# EAGLE design MEAS-ADXL354 (EAGLE 9.6.2)
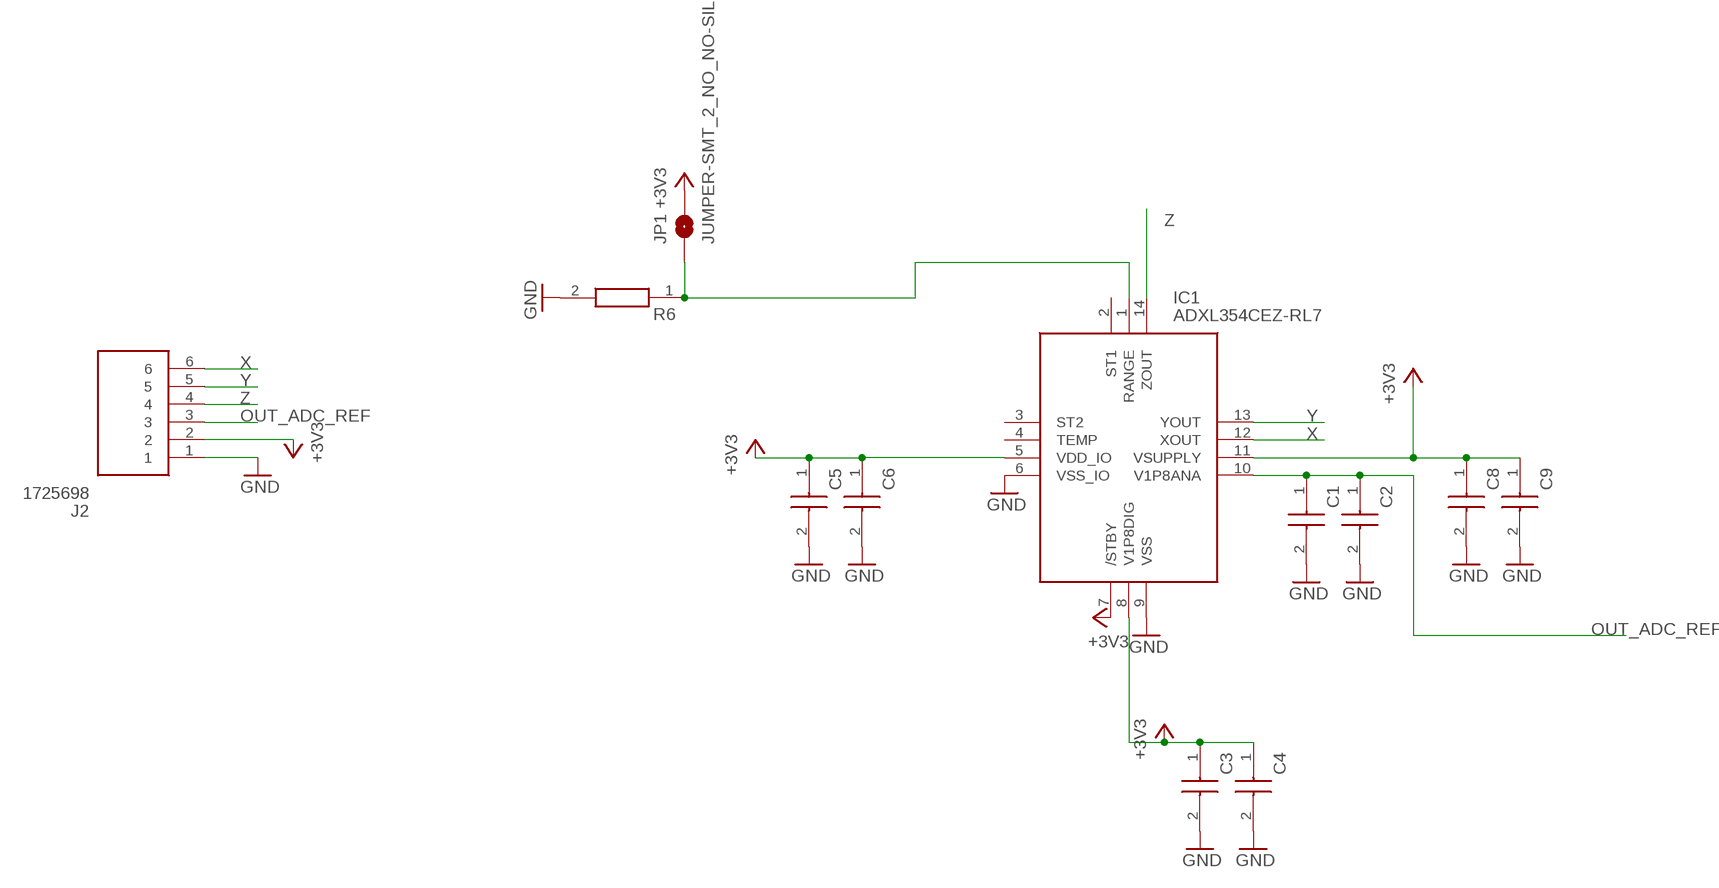
[diagram p0: schematic, sheet 1]

## Parts
C1  1.0uF  LMK105BJ225KV-F  [CAPC1005X55N]
C2  0.1uF  885012105010  [CAPC1005X55N]
C3  1.0uF  LMK105BJ225KV-F  [CAPC1005X55N]
C4  0.1uF  885012105010  [CAPC1005X55N]
C5  1.0uF  LMK105BJ225KV-F  [CAPC1005X55N]
C6  0.1uF  885012105010  [CAPC1005X55N]
C8  1.0uF  LMK105BJ225KV-F  [CAPC1005X55N]
C9  0.1uF  885012105010  [CAPC1005X55N]
IC1  ADXL354CEZ-RL7  [PLCC127P602X560X205-14N]
J2  1725698  [1725698]
JP1  JUMPER-SMT_2_NO_NO-SILK  [SMT-JUMPER_2_NO_NO-SILK]
R6  SFR03EZPF6801  [RESC1608X55N]

## Nets
+3V3: C3.1 C4.1 C5.1 C6.1 C8.1 C9.1 IC1.5(VDD_IO) IC1.7(/STBY) IC1.8(V1P8DIG) IC1.11(VSUPPLY) J2.2 JP1.2
GND: C1.2 C2.2 C3.2 C4.2 C5.2 C6.2 C8.2 C9.2 IC1.6(VSS_IO) IC1.9(VSS) J2.1 R6.2
N$1: IC1.1(RANGE) JP1.1 R6.1
OUT_ADC_REF: C1.1 C2.1 IC1.10(V1P8ANA) J2.3
X: IC1.12(XOUT) J2.6
Y: IC1.13(YOUT) J2.5
Z: IC1.14(ZOUT) J2.4
Unconnected: IC1.2(ST1) IC1.3(ST2) IC1.4(TEMP)

## Library data of the parts
C1 C3 C5 C8 = LMK105BJ225KV-F:LMK105BJ225KV-F: TAIYO YUDEN - LMK105BJ225KV-F - CAP ,MLCC ,0402,10V ,X5R,2.2UF10% ,T&R Source: Datasheet <https://datasheet.lcsc.com/szlcsc/Taiyo-Yuden-LMK105BJ225KV-F_C319191.pdf>; DESCRIPTION: TAIYO YUDEN - LMK105BJ225KV-F - CAP ,MLCC ,0402,10V ,X5R,2.2UF10% ,T&R; HEIGHT: 0.55mm; MANUFACTURER_NAME: TAIYO YUDEN; MANUFACTURER_PART_NUMBER: LMK105BJ225KV-F; MOUSER_PART_NUMBER: 963-LMK105BJ225KV-F; MOUSER_PRICE-STOCK: https://www.mouser.co.uk/ProductDetail/Taiyo-Yuden/LMK105BJ225KV-F?qs=lkMpTOwszhdMcDOeuc5Dig%3D%3D
C2 C4 C6 C9 = 885012105010:885012105010: Multilayer Ceramic Chip Capacitor WCAP-CSGP Series 0402 100000pF X5R0402104M010DFCT10000 Source: Datasheet <https://katalog.we-online.com/pbs/datasheet/885012105010.pdf>; DESCRIPTION: Multilayer Ceramic Chip Capacitor WCAP-CSGP Series 0402 100000pF X5R0402104M010DFCT10000; HEIGHT: 0.55mm; MANUFACTURER_NAME: Wurth Elektronik; MANUFACTURER_PART_NUMBER: 885012105010; MOUSER_PART_NUMBER: 710-885012105010; MOUSER_PRICE-STOCK: https://www.mouser.co.uk/ProductDetail/Wurth-Elektronik/885012105010?qs=0KOYDY2FL298aE%252BL5D%252BNKw%3D%3D
IC1 = ADXL354CEZ-RL7:ADXL354CEZ-RL7: Accelerometer Triple +/-2g/+/-8g 3.3V 368mv/g to 432mv/g/92mv/g to 108mv/g 14-Pin CLLCC T/R Source: Datasheet <https://www.analog.com/media/en/technical-documentation/data-sheets/ADXL354_355.pdf>; DESCRIPTION: Accelerometer Triple +/-2g/+/-8g 3.3V 368mv/g to 432mv/g/92mv/g to 108mv/g 14-Pin CLLCC T/R; HEIGHT: 2.05mm; MANUFACTURER_NAME: Analog Devices; MANUFACTURER_PART_NUMBER: ADXL354CEZ-RL7
J2 = 1725698:1725698: Conn PC Terminal Block 6 POS 2.54mm Solder ST Thru-Hole 6A Source: Datasheet <https://componentsearchengine.com/Datasheets/2/1725698.pdf>; DESCRIPTION: Conn PC Terminal Block 6 POS 2.54mm Solder ST Thru-Hole 6A; HEIGHT: 8.65mm; MANUFACTURER_NAME: Phoenix Contact; MANUFACTURER_PART_NUMBER: 1725698; MOUSER_PART_NUMBER: 651-1725698; MOUSER_PRICE-STOCK: https://www.mouser.co.uk/ProductDetail/Phoenix-Contact/1725698?qs=Ul7CXFMnlWUIR3VpVwwC4A%3D%3D
JP1 = SparkFun-Jumpers:JUMPER-SMT_2_NO: Normally open jumper This jumper has two pads in close proximity to each other. Apply solder to close the connection. Round pads are easier to solder for beginners, but are a lot larger. SparkFun Product that uses the round pads: SparkFun EL Sequencer <https://www.sparkfun.com/products/12781>
R6 = SamacSys_Parts:SFR03EZPF6801: Thick Film Resistors - SMD 0603 6.8Kohms 1% Anti-Sulfur AEC-Q200 Source: Datasheet <https://www.mouser.de/datasheet/2/348/sfr-e-1507454.pdf>; DESCRIPTION: Thick Film Resistors - SMD 0603 6.8Kohms 1% Anti-Sulfur AEC-Q200; HEIGHT: 0.55mm; MANUFACTURER_NAME: ROHM Semiconductor; MANUFACTURER_PART_NUMBER: SFR03EZPF6801

## Board
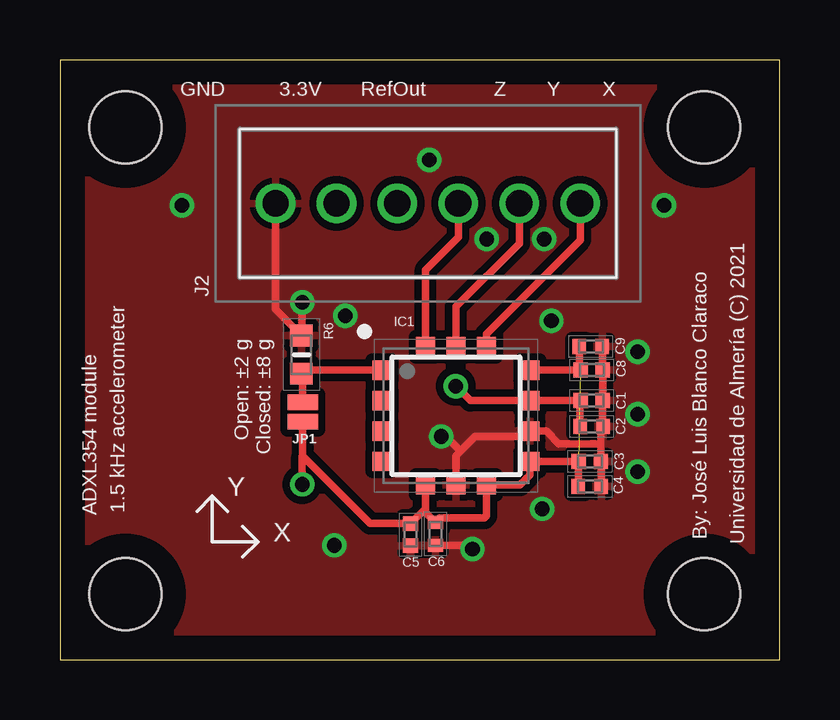
[diagram p1: board, top side]
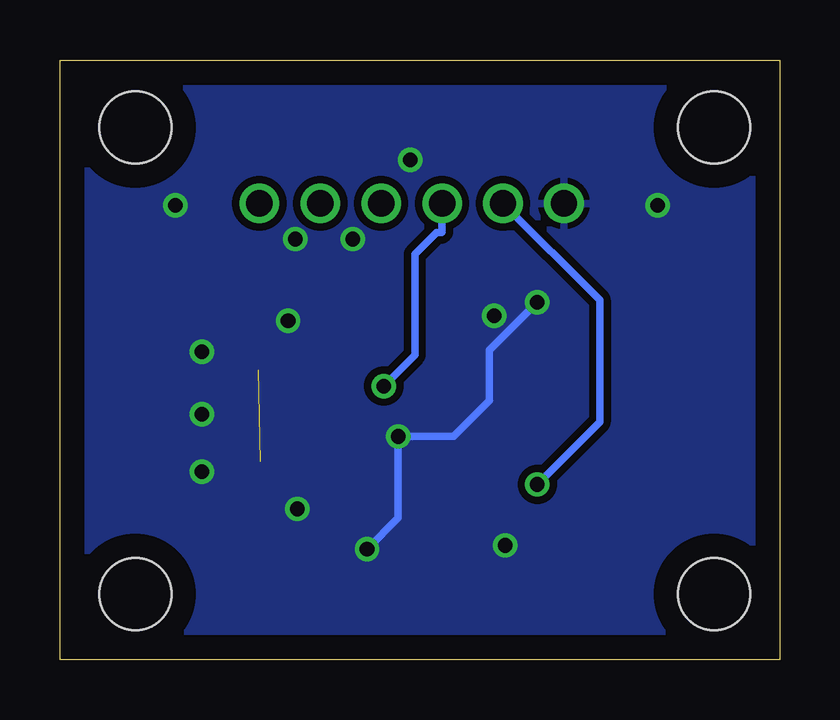
[diagram p2: board, bottom side, seen from below]

Size 30 x 25 mm. Coordinates in mm from the lower left corner, seen from the top.
Outline: 0,0 30,0 30,25 0,25 0,0
Copper layers (1*16): Top 0.035mm / dielectric 1.5mm / Bottom 0.035mm
Design rules "default": minimum track width 10mil, minimum drill 24mil, track to track 8mil, track to pad 8mil, pad to pad 8mil, via to via 8mil, smd to smd 8mil, copper to edge 40mil, drill to drill 8mil, minimum pad ring 10mil, minimum via ring 8mil, stop-mask expansion 4mil, vias tented up to drill 0mil, thermal gap 10mil
Holes 3 mm at 2.73,22.19 2.73,2.73 26.86,22.19 26.86,2.73

### Footprints (pad centres in the part's own frame; a part is rotated, then mirrored left to right if it is on the bottom)
CAPC1005X55N = smd 0.6 x 0.62: 1 -0.46,0; 2 0.46,0
CAPC1005X55N' = smd 0.56 x 0.62: 1 -0.48,0; 2 0.48,0
PLCC127P602X560X205-14N = smd 0.8 x 0.8: 1 -3.081,1.905; 2 -3.081,0.635; 3 -3.081,-0.635; 4 -3.081,-1.905; 5 -1.27,-2.881; 6 0,-2.881; 7 1.27,-2.881; 8 3.081,-1.905; 9 3.081,-0.635; 10 3.081,0.635; 11 3.081,1.905; 12 1.27,2.881; 13 0,2.881; 14 -1.27,2.881
1725698 = drill 1.1 pad 1.65: 1 0,0; 2 2.54,0; 3 5.08,0; 4 7.62,0; 5 10.16,0; 6 12.7,0
SMT-JUMPER_2_NO_NO-SILK = smd 0.635 x 1.27: 1 -0.406,0; 2 0.406,0
RESC1608X55N = smd 0.9 x 0.95: 1 -0.8,0; 2 0.8,0

### Placement (x,y rotation side)
C1  22.16,10.79 0 top
C2  0.1uF  [CAPC1005X55N']  22.16,9.72 0 top
C3  22.09,8.26 0 top
C4  0.1uF  [CAPC1005X55N']  22.09,7.22 0 top
C5  14.62,5.21 270 top
C6  0.1uF  [CAPC1005X55N']  15.65,5.24 270 top
C8  22.17,12.07 0 top
C9  0.1uF  [CAPC1005X55N']  22.13,13.06 0 top
IC1  16.51,10.16 0 top
J2  8.99,19.02 0 top
JP1  10.12,10.32 270 top
R6  10.06,12.71 90 top

### Tracks (layer width: path | path; a pad name or v marks a point on that pad's centre or on a via)
+3V3  (via drill 0.61)  (1 unrouted)
  Top 0.305: C9.1 21.65,12.13 C8.1 IC1.11 | C4.1 21.61,8.24 C3.1 IC1.8 19.59,7.69 19.18,7.28 IC1.7 17.78,5.98 17.7,5.9 15.83,5.9 C6.1 15.24,6.13 15.24,6.29 | IC1.5 15.24,6.29 | 15.24,6.29 C5.1 12.93,5.67 10.12,8.48 | JP1.2 10.12,8.48 | v10.1,7.3 10.1,8.46 10.12,8.48
  Bottom 0.305: J2.2 7.5,14.99 7.5,9.9 v10.1,7.3
GND  (via drill 0.61)
  Top 0.305: 22.55,9 C3.2 22.57,8.24 C4.2 | 22.55,9 22.55,9.63 C2.2 22.62,9.74 C1.2 22.63,10.8 C8.2 22.61,12.09 C9.2 | 22.55,9 20.8,9 20.27,9.53 IC1.9 19.37,9.3 17.3,9.3 16.7,8.7 | 16.7,8.7 16.5,8.5 IC1.6 | J2.1 8.99,14.59 R6.2 10.1,13.54 v10.1,14.9 | v15.9,9.3 16.1,9.3 16.7,8.7 | C6.2 17.04,4.76 v17.2,4.6
  Bottom 0.305: v10.1,14.9 12.1,12.9 12.1,10.8 13.6,9.3 v15.9,9.3 15.9,5.9 v17.2,4.6
  other vias: 11.44,4.76 20.11,6.28 20.49,14.13 5.09,18.93 25.19,18.93 24.09,12.83 24.09,10.23 24.09,7.83 11.89,14.33 20.19,17.53 17.79,17.53 15.39,20.83
  pour Bottom (isolate 0.305): 0,25.4 30.48,25.4 30.48,0 29.21,-1.27 1.27,-1.27 0,0
  pour Top (isolate 0.305): 30.48,25.4 0,25.4 0,0 1.27,-1.27 29.21,-1.27 30.48,0
N$1
  Top 0.305: IC1.1 10.22,12.06 R6.1 10.12,11.86 JP1.1
OUT_ADC_REF  (via drill 0.61)
  Top 0.305: v16.5,11.4 17.11,10.79 IC1.10 C1.1 21.68,10.78 C2.1
  Bottom 0.305: v16.5,11.4 15.2,12.7 15.2,16.9 14.3,17.8 14.1,17.8 14.07,17.83 J2.3
X
  Top 0.305: IC1.12 17.78,13.58 21.69,17.49 J2.6
Y
  Top 0.305: IC1.13 16.51,14.71 19.15,17.35 J2.5
Z
  Top 0.305: IC1.14 15.24,16.24 16.61,17.61 J2.4

### Text on the board
tPlace: GND | 3.3V | RefOut | Z | Y | X | Open: ±2 g / Closed: ±8 g | Y | ADXL354 module | 1.5 kHz accelerometer | X | By: José Luis Blanco Claraco | Universidad de Almería (C) 2021